# Altium schematic sheet Sheet.SchDoc
size A
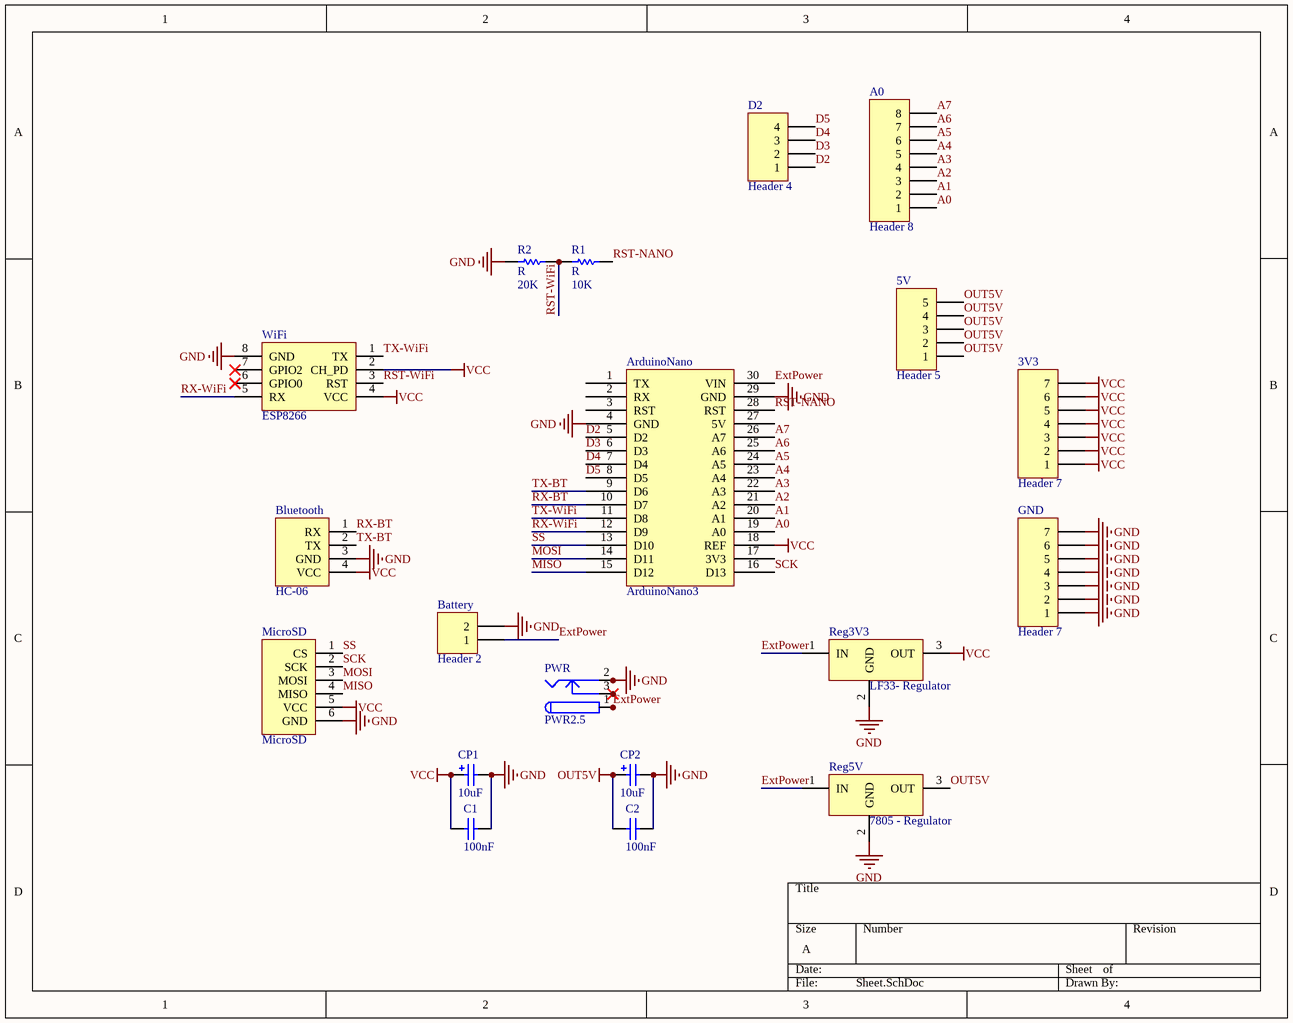
[diagram p0: Sheet.SchDoc]

## Parts
3V3  Header 7  [HDR1X7]
5V  Header 5  [HDR1X5]
A0  Header 8  [HDR1X8]
ArduinoNano  ArduinoNano3  [Nano3]
Battery  Header 2  [HDR1X2]
Bluetooth  HC-06  [HC-06]
C1  value 100nF  [C.1]  (hidden comment: Disk Cap)
C2  value 100nF  [C.1]  (hidden comment: Disk Cap)
CP1  value 10uF  [PC.15]  (hidden comment: Electrolytic Cap)
CP2  value 10uF  [PC.15]  (hidden comment: Electrolytic Cap)
D2  Header 4  [HDR1X4]
GND  Header 7  [HDR1X7]
MicroSD  MicroSD  [MicroSD]
PWR  PWR2.5  [KLD-0202]
R1  R  value 10K  [R.3]
R2  R  value 20K  [R.3]
Reg3V3  LF33- Regulator  [78XX]
Reg5V  7805 - Regulator  [78XX]
WiFi  ESP8266  [ESP8266Module]

## Nets
GND: ArduinoNano.4(GND) ArduinoNano.29(GND) Battery.2 Bluetooth.3(GND) C1.2 C2.2 CP1.2 CP2.2 GND.1 GND.2 GND.3 GND.4 GND.5 GND.6 GND.7 MicroSD.6(GND) PWR.2 PWR.2A PWR.2B R2.1 Reg3V3.2(GND) Reg5V.2(GND) WiFi.8(GND)
OUT5V: 5V.1 5V.2 5V.3 5V.4 5V.5 C2.1 CP2.1 Reg5V.3(OUT)
VCC: 3V3.1 3V3.2 3V3.3 3V3.4 3V3.5 3V3.6 3V3.7 ArduinoNano.18(REF) Bluetooth.4(VCC) C1.1 CP1.1 MicroSD.5(VCC) Reg3V3.3(OUT) WiFi.2(CH_PD) WiFi.4(VCC)
A0: A0.1 ArduinoNano.19(A0)
A1: A0.2 ArduinoNano.20(A1)
A2: A0.3 ArduinoNano.21(A2)
A3: A0.4 ArduinoNano.22(A3)
A4: A0.5 ArduinoNano.23(A4)
A5: A0.6 ArduinoNano.24(A5)
A6: A0.7 ArduinoNano.25(A6)
A7: A0.8 ArduinoNano.26(A7)
D2: ArduinoNano.5(D2) D2.1
D3: ArduinoNano.6(D3) D2.2
D4: ArduinoNano.7(D4) D2.3
D5: ArduinoNano.8(D5) D2.4
ExtPower: ArduinoNano.30(VIN) Battery.1 PWR.1 PWR.1A PWR.1B Reg3V3.1(IN) Reg5V.1(IN)
MISO: ArduinoNano.15(D12) MicroSD.4(MISO)
MOSI: ArduinoNano.14(D11) MicroSD.3(MOSI)
RST-NANO: ArduinoNano.28(RST) R1.2
RST-WiFi: R1.1 R2.2 WiFi.3(RST)
RX-BT: ArduinoNano.10(D7) Bluetooth.1(RX)
RX-WiFi: ArduinoNano.12(D9) WiFi.5(RX)
SCK: ArduinoNano.16(D13) MicroSD.2(SCK)
SS: ArduinoNano.13(D10) MicroSD.1(CS)
TX-BT: ArduinoNano.9(D6) Bluetooth.2(TX)
TX-WiFi: ArduinoNano.11(D8) WiFi.1(TX)
NetPWR_3: PWR.3 PWR.3A PWR.3B

Not connected (* = marked no-connect by the designer): ArduinoNano 1(TX) 2(RX) 3(RST) 17(3V3) 27(5V); WiFi 6(GPIO0)* 7(GPIO2)*

## Library data of the parts
3V3 GND = Header 7: Header, 7-Pin; LatestRevisionDate: 17-Jul-2002; LatestRevisionNote: Re-released for DXP Platform.; Publisher: Altium Limited
5V = Header 5: Header, 5-Pin; LatestRevisionDate: 17-Jul-2002; LatestRevisionNote: Re-released for DXP Platform.; Publisher: Altium Limited
A0 = Header 8: Header, 8-Pin; LatestRevisionDate: 17-Jul-2002; LatestRevisionNote: Re-released for DXP Platform.; Publisher: Altium Limited
Battery = Header 2: Header, 2-Pin; LatestRevisionDate: 17-Jul-2002; LatestRevisionNote: Re-released for DXP Platform.; Publisher: Altium Limited
C1 C2 = C: Capacitor; Manufacturer: Generic Components; Class: Passive; Published: 08/06/2000; Publisher: Altium Hobart Technology Centre; SubClass: Capacitor
CP1 CP2 = CP: Polarized Capacitor (Radial); Manufacturer: Generic Components; Class: Passive; Published: 08/06/2000; Publisher: Altium Hobart Technology Centre; SubClass: Capacitor
D2 = Header 4: Header, 4-Pin; LatestRevisionDate: 17-Jul-2002; LatestRevisionNote: Re-released for DXP Platform.; Publisher: Altium Limited
PWR = PWR2.5: Low Voltage Power Supply Connector; Published: 17-Dec-2003; DatasheetDocument: 09-May-2002; Publisher: Altium Limited; ComponentLink1Description: Manufacturer Link; ComponentLink1URL: http://domino.kycon.com/internet/Products.html
R1 R2 = R: Resistor; Manufacturer: Generic Components; Class: Passive; Published: 08/06/2000; Publisher: Altium Hobart Technology Centre; SubClass: Resistor
Reg3V3 Reg5V = Regulator: Voltage Regulator